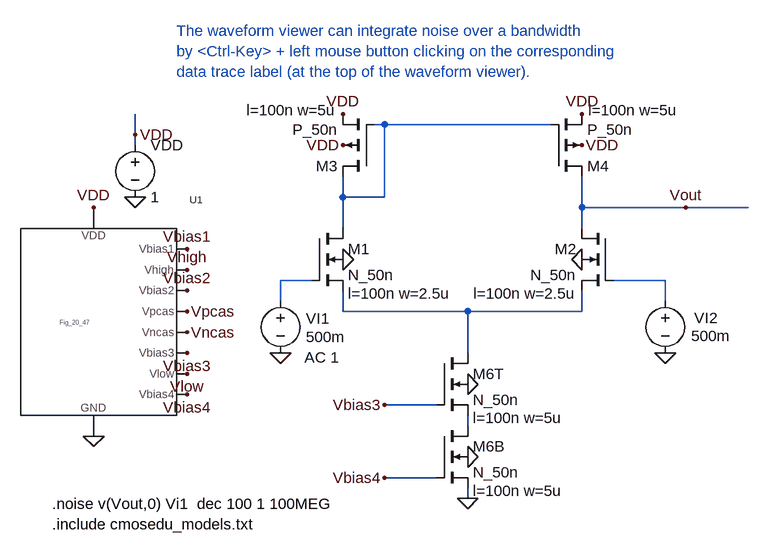
[diagram p0: schematic NOISE_Fig22_20.asc]
NOISE_Fig22_20.asc, the LTspice schematic file:
Version 4
SHEET 1 1888 680
WIRE 1248 -368 1232 -368
WIRE 1504 -368 1248 -368
WIRE 864 -352 864 -384
WIRE 864 -336 864 -352
WIRE 1184 -256 1184 -288
WIRE 1248 -256 1248 -368
WIRE 1248 -256 1184 -256
WIRE 1552 -240 1552 -288
WIRE 1712 -240 1552 -240
WIRE 1808 -240 1712 -240
WIRE 1184 -208 1184 -256
WIRE 1552 -208 1552 -240
WIRE 1136 -128 1088 -128
WIRE 1680 -128 1600 -128
WIRE 1088 -96 1088 -128
WIRE 1680 -96 1680 -128
WIRE 1184 -80 1184 -112
WIRE 1376 -80 1184 -80
WIRE 1552 -80 1552 -112
WIRE 1552 -80 1376 -80
WIRE 1376 -16 1376 -80
WIRE 1328 64 1248 64
WIRE 1376 96 1376 80
WIRE 1328 176 1248 176
WIRE 1376 208 1376 192
FLAG 864 -256 0
FLAG 864 -352 VDD
FLAG 1552 -160 0
FLAG 1376 208 0
FLAG 1184 -160 0
FLAG 1552 -384 VDD
FLAG 1552 -336 VDD
FLAG 1184 -336 VDD
FLAG 800 -240 VDD
FLAG 800 112 0
FLAG 944 -176 Vbias1
FLAG 944 -144 Vhigh
FLAG 944 -112 Vbias2
FLAG 944 -16 Vbias3
FLAG 944 -80 Vpcas
FLAG 944 -48 Vncas
FLAG 944 48 Vbias4
FLAG 944 16 Vlow
FLAG 1088 -16 0
FLAG 1184 -384 VDD
FLAG 1376 32 0
FLAG 1376 144 0
FLAG 1248 64 Vbias3
FLAG 1248 176 Vbias4
FLAG 1680 -16 0
FLAG 1712 -240 Vout
SYMBOL voltage 864 -352 R0
WINDOW 123 0 0 Left 2
WINDOW 39 0 0 Left 2
SYMATTR InstName VDD
SYMATTR Value 1
SYMBOL nmos4 1600 -208 M0
WINDOW 123 56 100 Left 2
SYMATTR Value2 l=100n w=2.5u
SYMATTR InstName M2
SYMATTR Value N_50n
SYMBOL nmos4 1136 -208 R0
WINDOW 123 56 100 Left 2
SYMATTR Value2 l=100n w=2.5u
SYMATTR InstName M1
SYMATTR Value N_50n
SYMBOL pmos4 1504 -288 M180
WINDOW 123 58 102 Left 2
WINDOW 0 56 16 Left 2
SYMATTR Value2 l=100n w=5u
SYMATTR InstName M4
SYMATTR Value P_50n
SYMBOL pmos4 1232 -288 R180
WINDOW 123 58 102 Left 2
WINDOW 0 56 16 Left 2
SYMATTR Value2 l=100n w=5u
SYMATTR InstName M3
SYMATTR Value P_50n
SYMBOL Fig_20_47 800 -64 R0
SYMATTR InstName U1
SYMBOL voltage 1088 -112 R0
WINDOW 0 39 43 Left 2
WINDOW 123 37 103 Left 2
WINDOW 39 0 0 Left 2
WINDOW 3 39 71 Left 2
SYMATTR InstName VI1
SYMATTR Value2 AC 1
SYMATTR Value 500m
SYMBOL nmos4 1328 -16 R0
WINDOW 123 56 100 Left 2
SYMATTR Value2 l=100n w=5u
SYMATTR InstName M6T
SYMATTR Value N_50n
SYMBOL nmos4 1328 96 R0
WINDOW 123 56 100 Left 2
SYMATTR Value2 l=100n w=5u
SYMATTR InstName M6B
SYMATTR Value N_50n
SYMBOL voltage 1680 -112 R0
WINDOW 0 45 42 Left 2
WINDOW 3 40 70 Left 2
WINDOW 123 0 0 Left 2
WINDOW 39 0 0 Left 2
SYMATTR InstName VI2
SYMATTR Value 500m
TEXT 736 248 Left 2 !.include cmosedu_models.txt
TEXT 928 -512 Left 2 ;The waveform viewer can integrate noise over a bandwidth \nby <Ctrl-Key> + left mouse button clicking on the corresponding \ndata trace label (at the top of the waveform viewer).
TEXT 736 216 Left 2 !.noise v(Vout,0) Vi1  dec 100 1 100MEG

The netlist it stands for:
* NOISE_Fig22_20.asc
VDD VDD 0 1
M2 Vout N003 N004 0 N_50n l=100n w=2.5u
M1 N001 N002 N004 0 N_50n l=100n w=2.5u
M4 Vout N001 VDD VDD P_50n l=100n w=5u
M3 N001 N001 VDD VDD P_50n l=100n w=5u
XU1 Vbias1 Vhigh Vbias2 Vpcas Vncas Vbias3 Vlow Vbias4 VDD 0 Fig_20_47  ; pins Vbias1 Vhigh Vbias2 Vpcas Vncas Vbias3 Vlow Vbias4 VDD GND
VI1 N002 0 500m AC 1
M6T N004 Vbias3 N005 0 N_50n l=100n w=5u
M6B N005 Vbias4 0 0 N_50n l=100n w=5u
VI2 N003 0 500m
.model NMOS NMOS
.model PMOS PMOS
.lib standard.mos
.include cmosedu_models.txt
* The waveform viewer can integrate noise over a bandwidth
* by <Ctrl-Key> + left mouse button clicking on the corresponding
* data trace label (at the top of the waveform viewer).
.noise v(Vout,0) Vi1  dec 100 1 100MEG
.backanno
.end